# EAGLE schematic bionic glove vin connection (EAGLE 8.4.3)
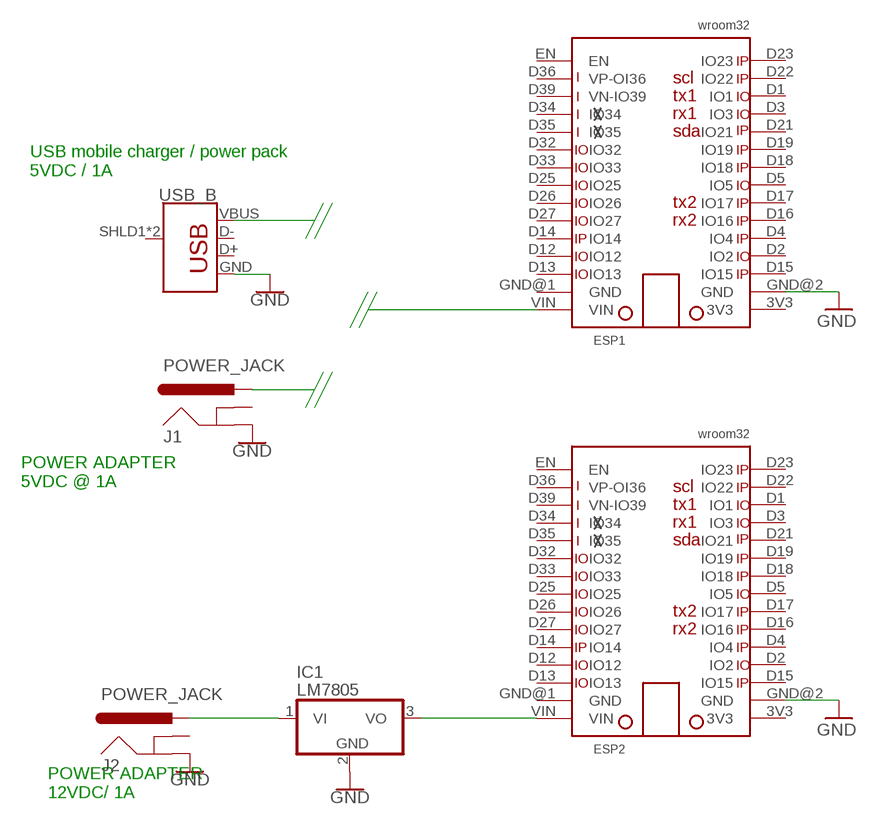
[diagram p0: schematic, sheet 1]

## Parts
ESP1  wroom32  ESP32DEVKITV1  [ESP32-DEVKITV1]
ESP2  wroom32  ESP32DEVKITV1  [ESP32-DEVKITV1]
IC1  LM7805  7808T  [TO220H]
J1  POWER_JACK  [POWER_JACK_PTH]
J2  POWER_JACK  [POWER_JACK_PTH]
USB_B  USB_B_PTH  [USB-B-PTH]

## Nets
+5V_USB: ESP1.VIN
+5V_USB1: ESP2.VIN IC1.3(VO)
GND: ESP1.GND@2(GND) ESP2.GND@2(GND) IC1.2(GND) J1.GND J2.GND USB_B.GND
N$2: IC1.1(VI) J2.PWR
N$4: J1.PWR
N$9: USB_B.VBUS
Unconnected: ESP1.3V3 ESP1.D1(IO1) ESP1.D2(IO2) ESP1.D3(IO3) ESP1.D4(IO4) ESP1.D5(IO5) ESP1.D12(IO12) ESP1.D13(IO13) ESP1.D14(IO14) ESP1.D15(IO15) ESP1.D16(IO16) ESP1.D17(IO17) ESP1.D18(IO18) ESP1.D19(IO19) ESP1.D21(IO21) ESP1.D22(IO22) ESP1.D23(IO23) ESP1.D25(IO25) ESP1.D26(IO26) ESP1.D27(IO27) ESP1.D32(IO32) ESP1.D33(IO33) ESP1.D34(IO34) ESP1.D35(IO35) ESP1.D36(VP-OI36) ESP1.D39(VN-IO39) ESP1.EN ESP1.GND@1(GND) ESP2.3V3 ESP2.D1(IO1) ESP2.D2(IO2) ESP2.D3(IO3) ESP2.D4(IO4) ESP2.D5(IO5) ESP2.D12(IO12) ESP2.D13(IO13) ESP2.D14(IO14) ESP2.D15(IO15) ESP2.D16(IO16) ESP2.D17(IO17) ESP2.D18(IO18) ESP2.D19(IO19) ESP2.D21(IO21) ESP2.D22(IO22) ESP2.D23(IO23) ESP2.D25(IO25) ESP2.D26(IO26) ESP2.D27(IO27) ESP2.D32(IO32) ESP2.D33(IO33) ESP2.D34(IO34) ESP2.D35(IO35) ESP2.D36(VP-OI36) ESP2.D39(VN-IO39) ESP2.EN ESP2.GND@1(GND) J1.GNDBREAK J2.GNDBREAK USB_B.D+ USB_B.D- USB_B.SHLD1(SHIELD) USB_B.SHLD2(SHIELD)

## Notes on the sheet
- USB mobile charger / power pack
  5VDC / 1A
- POWER ADAPTER
  5VDC @ 1A
- POWER ADAPTER
  12VDC/ 1A

## Library data of the parts
ESP1 ESP2 = PantalaLabsPanels:ESP32DEVKITV1
IC1 = PantalaLabsPanels:78*: Positive VOLTAGE REGULATOR Source: http://cache.national.com/ds/LM/LM78L05.pdf http://www.fairchildsemi.com/ds/LM/LM7805.pdf
J1 J2 = PantalaLabsPanels:POWER_JACK: Power Jack Connector This is the standard 5.5mm barrel jack for power. The PTH is the most common, proven, reliable, footprint. The Slot footprint only works if the mill layer is transmitted to the PCB fab house so be warned. Here are the connectors we sell at SparkFun: DC Barrel Power Jack/Connector <https://www.sparkfun.com/products/119> (PRT-00119) DC Barrel Power Jack/Connector (SMD) <https://www.sparkfun.com/products/12748> (PRT-12748) DC Barrel Jack Adapter - Breadboard Compatible <https://www.sparkfun.com/products/10811> (PRT-10811) It is used on this SparkFun product (and many, many others): SparkFun RedBoard - Programmed with Arduino <https://www.sparkfun.com/products/12757> (DEV-12757) Also, if you need a mating power supply or connector, please check these out: Wall Adapter Power Supply - 9VDC 650mA <https://www.sparkfun.com/products/298> (TOL-00298) DC Barrel Jack Adapter - Male <https://www.sparkfun.com/products/10287> (PRT-10287); PROD_ID: CONN-08197
USB_B = PantalaLabsPanels:USB_B: USB Type B Connector SparkFun Products: SparkFun Stepoko <https://www.sparkfun.com/products/13899> PTH; PROD_ID: CONN-08278; SF_ID: PRT-00139

## Net classes
0 default: width 0.3 mm, drill 0.5 mm, clearance 0.4 mm